# EAGLE design nanov6 (EAGLE 6.5.0)
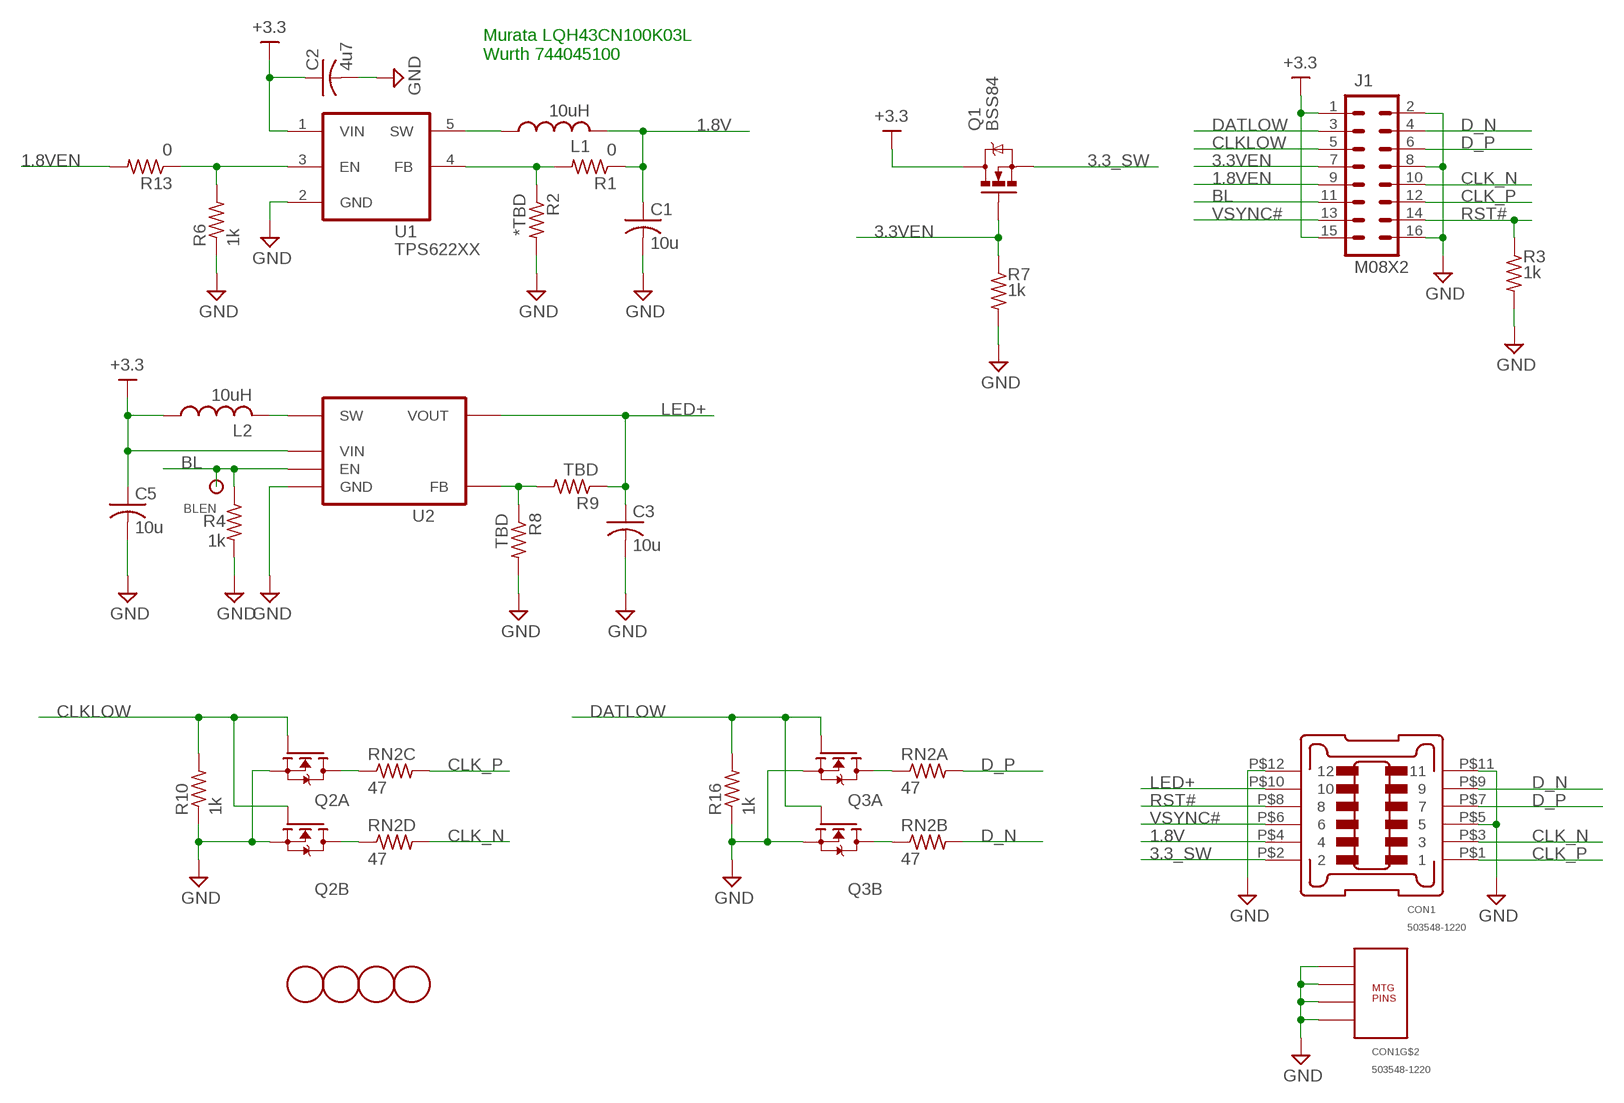
[diagram p0: schematic, sheet 1]

## Parts
BLEN  TESTPOINTKEYSTONE_5016  [5016]
C1  10u  C-USC0805  [C0805]
C2  4u7  C-USC0805  [C0805]
C3  10u  C-USC0805  [C0805]
C5  10u  C-USC0805  [C0805]
CON1  503548-1220  [503548-1220]
J1  M08X2  [2X8]
L1  10uH  L-USL1812  [L1812]
L2  10uH  L-USL1812  [L1812]
Q1  BSS84  MOSFET-NCHANNELSMD  [SOT23-3]
Q2  2N7002SC70-6  [SC70-6]
Q3  2N7002SC70-6  [SC70-6]
R1  0  R-US_R0805  [R0805]
R2  *TBD  R-US_R0805  [R0805]
R3  1k  R-US_R0805  [R0805]
R4  1k  R-US_R0805  [R0805]
R6  1k  R-US_R0805  [R0805]
R7  1k  R-US_R0805  [R0805]
R8  TBD  R-US_R0805  [R0805]
R9  TBD  R-US_R0805  [R0805]
R10  1k  R-US_R0805  [R0805]
R13  0  R-US_R0805  [R0805]
R16  1k  R-US_R0805  [R0805]
RN2  47  RES_NETWORK0805  [2008]
U1  TPS622XX  [SOT23-5]
U2  TLV61220  [SOT23-6]
U$2  MOUNTING_HOLE125  [HOLE_MTG_125]
U$3  MOUNTING_HOLE125  [HOLE_MTG_125]
U$11  MOUNTING_HOLE125  [HOLE_MTG_125]
U$15  MOUNTING_HOLE125  [HOLE_MTG_125]

## Nets
1.8V: C1.1 CON1.P$4 L1.2 R1.1
1.8VEN: J1.9 R13.2
3.3_SW: CON1.P$2 Q1.2(S)
3.3VEN: J1.7 Q1.1(G) R7.1
+3.3: C2.1 C5.1 J1.1 J1.15 L2.1 Q1.3(D) U1.1(VIN) U2.6(VIN)
BL: BLEN.P$1 J1.11 R4.1 U2.3(EN)
CLK_N [MIPI]: CON1.P$3 J1.10 RN2.5
CLK_P [MIPI]: CON1.P$1 J1.12 RN2.6
CLKLOW: J1.5 Q2.2(B:G) Q2.5(A:G) R10.2
D_N [MIPI]: CON1.P$9 J1.4 RN2.7
D_P [MIPI]: CON1.P$7 J1.6 RN2.8
DATLOW: J1.3 Q3.2(B:G) Q3.5(A:G) R16.2
GND: C1.2 C2.2 C3.2 C5.2 CON1.MTG1 CON1.MTG2 CON1.MTG3 CON1.MTG4 CON1.P$5 CON1.P$11 CON1.P$12 J1.2 J1.8 J1.16 Q2.1(B:S) Q2.4(A:S) Q3.1(B:S) Q3.4(A:S) R2.2 R3.2 R4.2 R6.1 R7.2 R8.2 R10.1 R16.1 U1.2(GND) U2.2(GND)
LED+: C3.1 CON1.P$10 R9.1 U2.5(VOUT)
N$1: R6.2 R13.1 U1.3(EN)
N$2: L1.1 U1.5(SW)
N$7: L2.2 U2.1(SW)
N$13: R8.1 R9.2 U2.4(FB)
N$16: Q2.3(A:D) RN2.3
N$17: Q2.6(B:D) RN2.4
N$18: Q3.3(A:D) RN2.1
N$19: Q3.6(B:D) RN2.2
N$23: R1.2 R2.1 U1.4(FB)
RST#: CON1.P$8 J1.14 R3.1
VSYNC#: CON1.P$6 J1.13

## Notes on the sheet
- Murata LQH43CN100K03L
  Wurth 744045100

## Library data of the parts
BLEN = ak-misc:TESTPOINT: Various test points
C1-C3 C5 = rcl:C-US: CAPACITOR, American symbol
CON1 = ak-misc:503548-1220
J1 = SparkFun:M08X2
L1 L2 = rcl:L-US: INDUCTOR, American symbol
Q1 = SparkFun:MOSFET-NCHANNEL
Q2 Q3 = ak-misc:2N7002
R1-R4 R6-R10 R13 R16 = rcl:R-US_: RESISTOR, American symbol
RN2 = ak-misc:RES_NETWORK
U1 = ak-misc:TPS622XX
U2 = ak-misc:TLV61220
U$2 U$3 U$11 U$15 = ak-misc:MOUNTING_HOLE

## Net classes
1 MIPI: width 0.3 mm, drill 0.3 mm, clearance 0.15 mm

## Board
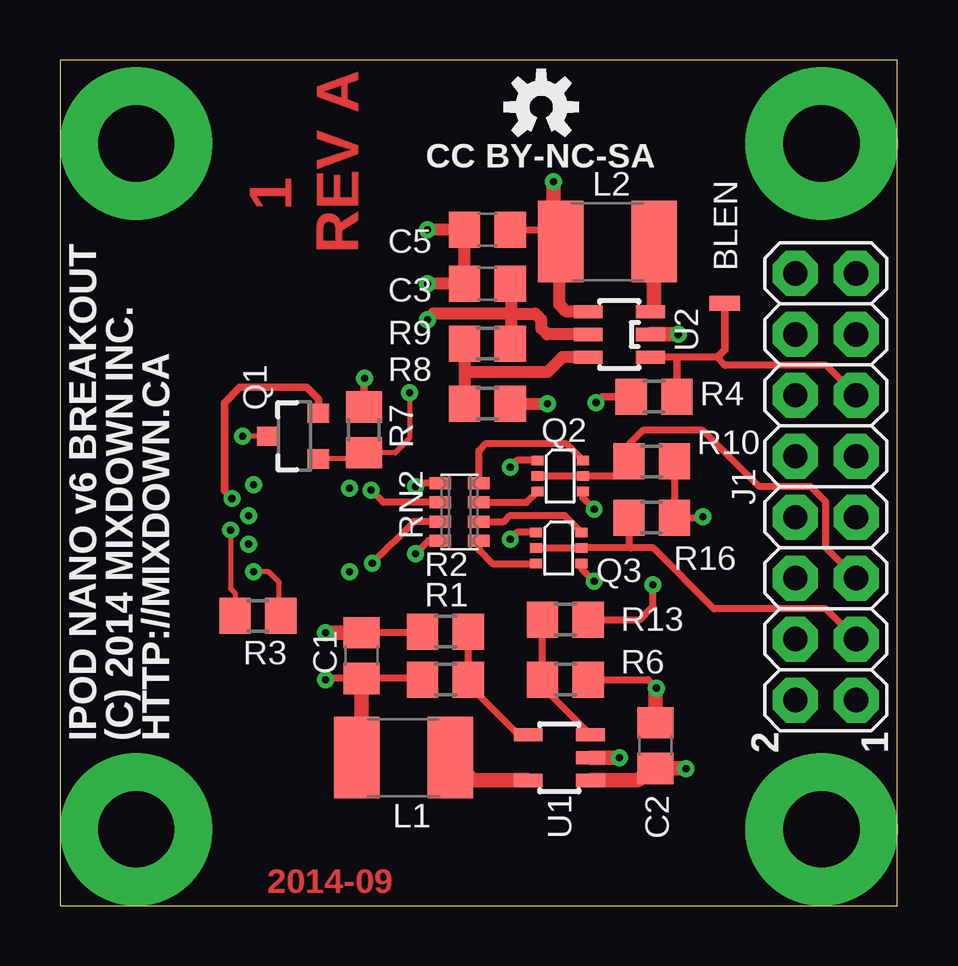
[diagram p1: board, top side]
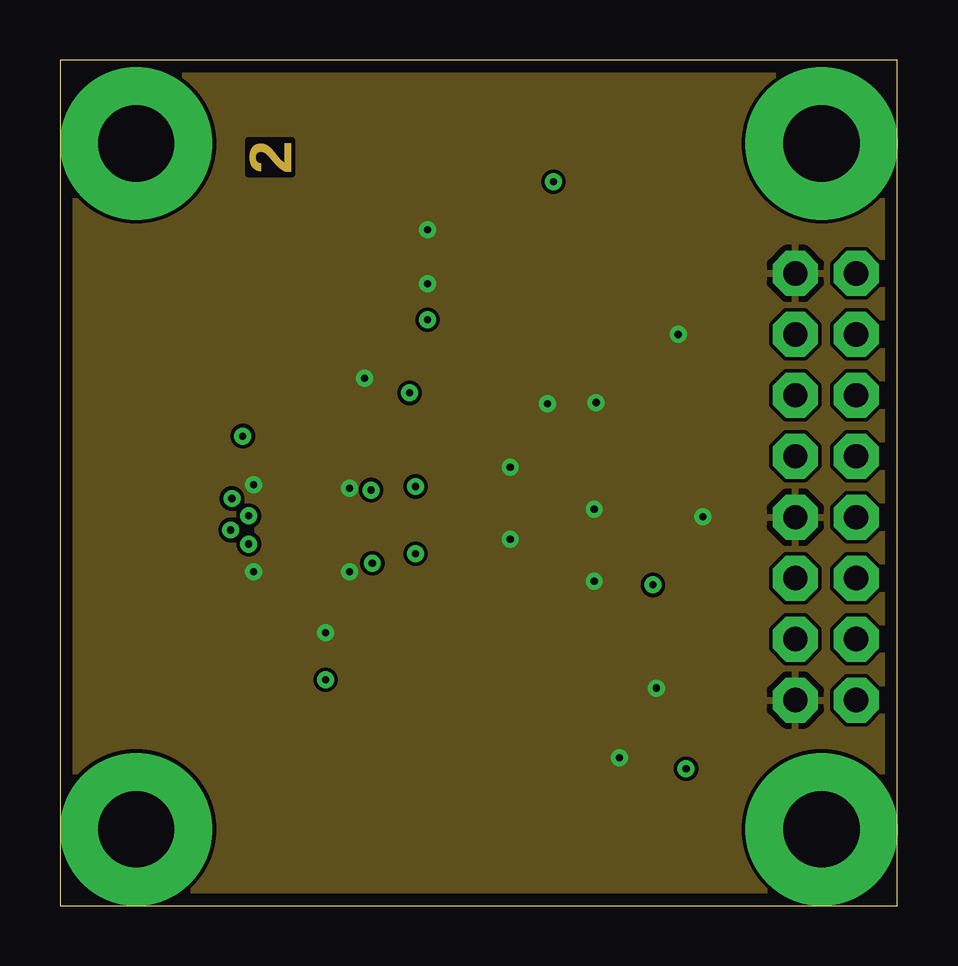
[diagram p2: board, inner layer Route2]
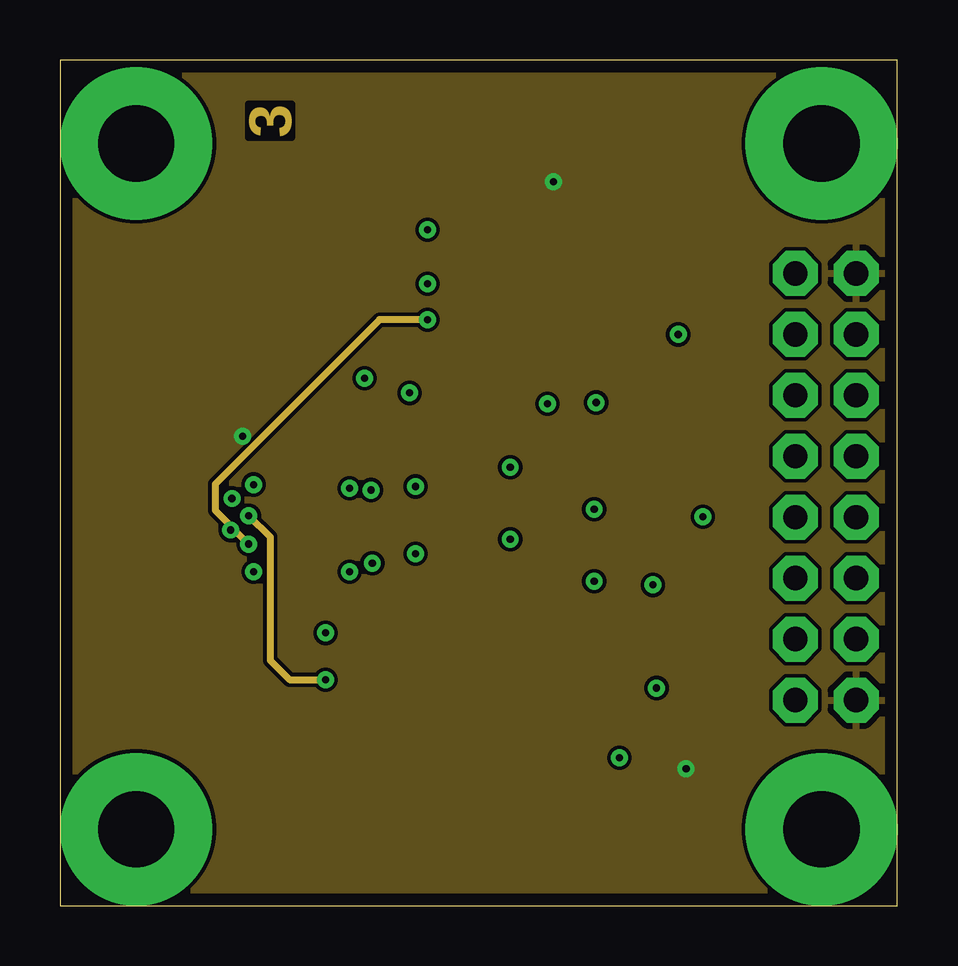
[diagram p3: board, inner layer Route15]
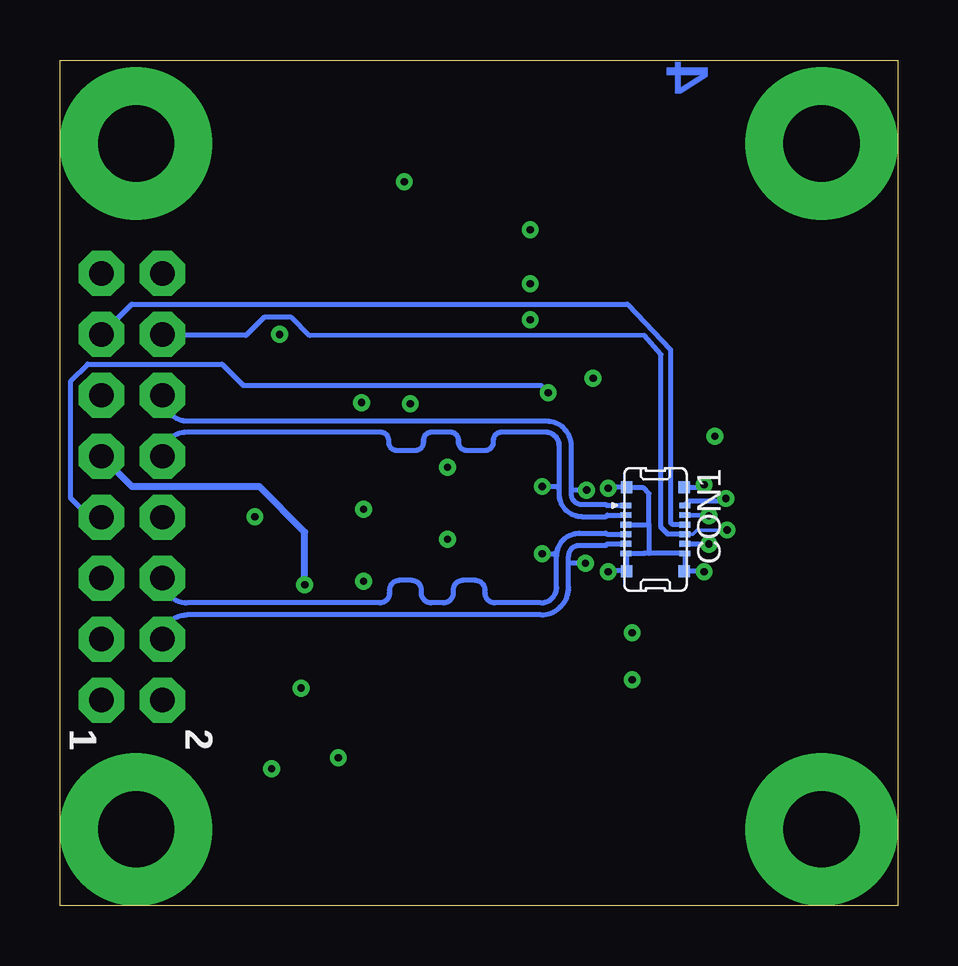
[diagram p4: board, bottom side, seen from below]

Size 34.91 x 35.23 mm. Coordinates in mm from the lower left corner, seen from the top.
Outline: 0,0 34.91,0 34.91,35.23 0,35.23 0,0
Copper layers (1+2*15+16): Top 0.0178mm / dielectric 12mil / Route2 0.0356mm / dielectric 28mil / Route15 0.0356mm / dielectric 12mil / Bottom 0.0178mm
Design rules "ssc-4l-thermals-stopmask-via": minimum track width 6mil, minimum drill 8mil, track to track 6mil, track to pad 6mil, pad to pad 6mil, via to via 6mil, smd to smd 6mil, copper to edge 20mil, drill to drill 16mil, minimum pad ring 8mil, minimum via ring 8mil, stop-mask expansion 3mil, vias tented up to drill 12mil, thermal gap 10mil

### Footprints (pad centres in the part's own frame; a part is rotated, then mirrored left to right if it is on the bottom)
5016 = smd 1.27 x 0.635: P$1 0,0
C0805 = smd 1.3 x 1.5: 1 -0.95,0; 2 0.95,0
503548-1220 = smd 0.5 x 0.47: MTG1 1.75,1.195; MTG2 1.75,-1.195; MTG3 -1.75,-1.195; MTG4 -1.75,1.195 | smd 0.24 x 0.45: P$1 1,1.225; P$2 1,-1.225; P$3 0.6,1.225; P$4 0.6,-1.225; P$5 0.2,1.225; P$6 0.2,-1.225; P$7 -0.2,1.225; P$8 -0.2,-1.225; P$9 -0.6,1.225; P$10 -0.6,-1.225; P$11 -1,1.225; P$12 -1,-1.225
2X8 = drill 1.016 pad 1.88 octagon: 1 0,0; 2 0,2.54; 3 2.54,0; 4 2.54,2.54; 5 5.08,0; 6 5.08,2.54; 7 7.62,0; 8 7.62,2.54; 9 10.16,0; 10 10.16,2.54; 11 12.7,0; 12 12.7,2.54; 13 15.24,0; 14 15.24,2.54; 15 17.78,0; 16 17.78,2.54
L1812 = smd 1.9 x 3.4: 1 -1.95,0; 2 1.95,0
SOT23-3 = smd 0.8 x 0.9: 1 -0.95,-1; 2 0.95,-1; 3 0,1.1
SC70-6 = smd 0.5 x 0.4: 1 -0.95,0.65; 2 -0.95,0; 3 -0.95,-0.65; 4 0.95,-0.65; 5 0.95,0; 6 0.95,0.65
R0805 = smd 1.3 x 1.5: 1 -0.95,0; 2 0.95,0
2008 = smd 0.5 x 0.9: 1 -1.2,-0.8; 2 -0.4,-0.8; 3 0.4,-0.8; 4 1.2,-0.8; 5 1.2,0.8; 6 0.4,0.8; 7 -0.4,0.8; 8 -1.2,0.8
SOT23-5 = smd 0.55 x 1.2: 1 -0.95,-1.3; 2 0,-1.3; 3 0.95,-1.3; 4 0.95,1.3; 5 -0.95,1.3
SOT23-6 = smd 0.55 x 1.2: 1 0.95,-1.3; 2 0,-1.3; 3 -0.95,-1.3; 4 -0.95,1.3; 5 0,1.3; 6 0.95,1.3
HOLE_MTG_125 = drill 3.175 pad 6.35: P$1 0,0

### Placement (x,y rotation side)
BLEN  27.71,25.09 0 top
C1  12.57,10.41 90 top
C2  24.82,6.66 90 top
C3  17.82,25.91 180 top
C5  17.82,28.16 180 top
CON1  10.1,15.67 90 bottom
J1  33.2,8.56 90 top
L1  14.32,6.16 180 top
L2  22.82,27.66 0 top
Q1  9.78,19.56 90 top
Q2  20.85,17.9 0 top
Q3  20.79,14.9 0 top
R1  16.07,9.41 0 top
R2  16.07,11.41 180 top
R3  8.26,12.06 0 top
R4  24.77,21.21 180 top
R6  21.07,9.41 180 top
R7  12.67,19.82 90 top
R8  17.82,20.91 0 top
R9  17.82,23.41 180 top
R10  24.67,18.51 180 top
R13  21.07,11.91 0 top
R16  24.67,16.16 180 top
RN2  16.66,16.4 90 top
U1  20.82,6.16 90 top
U2  23.32,23.8 90 top
U$2  3.17,3.17 0 top
U$3  31.75,3.17 0 top
U$11  31.75,31.75 0 top
U$15  3.17,31.75 0 top

### Tracks (layer width: path | path; a pad name or v marks a point on that pad's centre or on a via)
1.8V  (via drill 0.3 pad 0.3)
  Top 0.3: R1.1 15.07,9.46 C1.1 11.12,9.46 v11.07,9.41 | L1.2 12.57,6.36
  Top 0.6: 12.57,6.36 C1.1
  Route15 0.3: v11.07,9.41 9.57,9.41 8.77,10.21 8.77,15.36 v7.87,16.23
  Bottom 0.2: v7.87,16.23 8.87,16.26 CON1.P$4
1.8VEN  (via drill 0.3 pad 0.3)
  Top 0.3: R13.2 24.17,11.91 24.72,12.46 v24.72,13.36
  Bottom 0.3: v24.72,13.36 24.72,15.56 26.62,17.46 31.93,17.46 J1.9
3.3_SW  (via drill 0.3 pad 0.3)
  Top 0.305: Q1.2 10.78,21.1 10.29,21.59 7.49,21.59 6.86,20.95 6.86,17.27 v7.17,16.96
  Bottom 0.2: CON1.P$2 8.69,16.86 7.27,16.86 v7.17,16.96
3.3VEN  (via drill 0.3 pad 0.3)
  Top 0.2: v14.57,21.36 14.57,19.46 13.97,18.86 R7.1
  Top 0.203: R7.1 12.43,18.61 Q1.1
  Bottom 0.2: J1.7 33.7,16.18 34.48,16.96 34.48,21.86 33.77,22.56 28.17,22.56 27.27,21.66 14.87,21.66 v14.57,21.36
+3.3  (via drill 0.3, 0.3 pad 0.3)
  Top 0.203: Q1.3 v7.62,19.56
  Top 0.3: 20.82,27.11 L2.1 | C5.1 20.32,28.16 21.07,27.41
  Top 0.5: U2.6 21.12,24.75 20.82,25.05 20.82,27.11 | 20.57,28.16 21.07,27.66 21.07,27.41 21.07,27.11 L2.1
  Top 0.6: U1.1 24.07,5.21 C2.1 v26.09,5.71 v26.1,5.7 | 20.57,28.16 v20.57,30.16
  pour Route15: 35.32,0.64 35.32,34.73 0.42,34.73 0.42,0.64
BL
  Top 0.3: J1.11 31.95,22.51 27.72,22.51 27.71,22.52 27.4,22.84 25.78,22.84 U2.3
  Top 0.305: BLEN.P$1 27.71,23.16 27.4,22.84 | R4.1 25.71,22.78 25.78,22.84
CLK_N  (via drill 0.3 pad 0.3)
  Top 0.3: 14.86,17.5 v14.82,17.46 14.96,17.6 RN2.5
  Bottom 0.2: 12.17,16.21 12.11,16.27
  Bottom 0.203: J1.10 arc90 29.64,19.73 21.57,19.73 arc90 21.23,19.39 21.23,19.31 arc-90 20.88,18.97 20.11,18.97 arc-90 19.77,19.31 19.77,19.39 arc90 19.42,19.73 18.66,19.73 arc90 18.31,19.39 18.31,19.31 arc-90 17.97,18.97 17.2,18.97 arc-90 16.86,19.31 16.86,19.39 arc90 16.51,19.73 14.69,19.73 arc90 14.12,19.16 14.12,17.36 | 14.12,17.36 14.12,17.16 arc-90 13.17,16.21 | 13.17,16.21 12.17,16.21 | 12.11,16.27 CON1.P$3 | 13.17,16.21 | v14.82,17.46 14.22,17.46 14.12,17.36
CLK_P  (via drill 0.3 pad 0.3)
  Top 0.3: RN2.6 13.48,16.8 v12.97,17.31
  Bottom 0.203: J1.12 arc-90 29.58,20.19 14.65,20.19 arc90 13.62,19.16 13.62,17.36 | 13.62,17.36 13.62,17.16 arc-90 13.17,16.71 12.17,16.71 12.13,16.67 CON1.P$1 | v12.97,17.31 13.57,17.31 13.62,17.36
CLKLOW
  Top 0.3: Q2.2 Q2.5 23.11,17.9 R10.2 23.72,19.22 24.3,19.8 26.8,19.8 29.15,17.45 31.3,17.45 31.93,16.82 31.93,14.91 J1.5
D_N  (via drill 0.3 pad 0.3)
  Top 0.3: v13.02,14.26 14.76,16 RN2.7
  Bottom 0.2: 12.17,15.01 arc90 12.16,15.02 12.11,15.07 CON1.P$9
  Bottom 0.203: J1.4 arc90 29.65,12.11 14.87,12.11 arc-90 13.72,13.26 13.72,14.26 | 13.72,14.26 13.72,14.56 arc90 13.27,15.01 12.17,15.01 | v13.02,14.26 13.72,14.26
D_P  (via drill 0.3 pad 0.3)
  Top 0.3: RN2.8 15.36,15.2 v14.82,14.66
  Bottom 0.2: 12.17,15.51 12.13,15.47 CON1.P$7
  Bottom 0.203: J1.6 arc-90 29.63,12.61 21.59,12.61 arc-90 21.19,13.02 21.19,13.14 arc90 20.78,13.55 20.26,13.55 arc90 19.86,13.14 19.86,13.02 arc-90 19.45,12.61 18.94,12.61 arc-90 18.53,13.02 18.53,13.14 arc90 18.13,13.55 17.61,13.55 arc90 17.21,13.14 17.21,13.02 arc-90 16.8,12.61 14.87,12.61 arc-90 14.22,13.26 14.22,14.56 | 14.22,14.56 arc90 13.27,15.51 12.17,15.51 | v14.82,14.66 14.32,14.66 14.22,14.56
DATLOW
  Top 0.3: Q3.2 Q3.5 | Q3.5 | J1.3 31.93,12.36 27.27,12.36 24.73,14.9 23.8,14.9 | 23.8,14.9 Q3.5 | 23.67,16.41 R16.2 23.72,14.98 23.8,14.9
GND  (via drill 0.3, 0.3 pad 0.3)
  Top 0.152: R3.2 9.14,12.13
  Top 0.203: 9.14,12.13 9.14,13.46 8.7,13.91 v8.07,13.91
  Top 0.3: Q2.1 19.06,18.55 v18.77,18.26 | Q2.4 21.8,16.98 v22.27,16.51 | Q3.1 19.06,15.55 v18.77,15.26 | Q3.4 21.74,14.04 v22.27,13.51 | R2.2 14.57,11.36 C1.2 | R6.1 24.52,9.41 v24.87,9.06 | R10.1 R16.1 26.76,16.16 v26.8,16.2
  Top 0.305: R7.2 12.67,21.81 v12.7,21.97 | R4.2 22.61,21.21 v22.35,20.95
  Top 0.5: v15.32,28.16 C5.2 C3.2 v15.32,25.91 | R8.2 v20.32,20.91
  Top 0.6: C1.2 v11.07,11.36 | U1.2 v23.32,6.16 | U2.2 v25.77,23.8 | C2.2 24.82,8.81 v24.87,9.06
  Bottom 0.2: CON1.P$11 10.57,14.66 10.56,14.67 | CON1.P$11 | 10.37,14.67 CON1.P$12 8.88,13.95 | 10.37,14.67 10.56,14.67 | 10.57,14.68 10.56,14.67 | CON1.P$11 11.31,13.94 | 11.31,13.94 CON1.MTG4 | 8.88,13.95 CON1.MTG3 | CON1.MTG2 8.08,17.42 v8.07,17.54 | CON1.P$5 10.37,15.87 | v12.07,17.39 12.06,17.42 CON1.MTG1 10.63,17.42 10.37,17.16 10.37,15.87 | 11.31,13.94 12.04,13.94 v12.07,13.91 | 8.88,13.95 8.11,13.95 v8.07,13.91 | 10.37,15.87 10.37,14.67
  pour Route2: 34.69,0.64 34.69,34.73 0.42,34.73 0.42,0.64
LED+  (via drill 0.3 pad 0.3)
  Top 0.5: U2.5 20.32,23.8 20.07,24.05 20.07,24.41 19.82,24.66 18.82,24.66 | R9.1 18.82,23.46 18.82,24.66 | 18.82,24.66 18.82,25.86 C3.1 | 18.82,24.66 15.57,24.66 v15.32,24.41
  Route15 0.3: v15.32,24.41 13.32,24.41 6.47,17.56 6.47,16.46 v7.87,15.06
  Bottom 0.2: v7.87,15.06 8.87,15.06 CON1.P$10
N$1
  Top 0.3: U1.3 20.12,9.11 R6.2 R13.1
N$2
  Top 0.6: U1.5 17.22,5.21 L1.1
N$7
  Top 0.203: U2.1 24.77,24.89
  Top 0.6: 24.77,24.89 L2.2
N$13
  Top 0.5: 20.32,22.23 16.87,22.21 | 16.87,22.21 R8.1 | R9.2 16.87,22.21
  Top 0.508: U2.4 20.94,22.84 20.32,22.23
N$16
  Top 0.3: RN2.3 19.45,16.8 Q2.3
N$17
  Top 0.3: RN2.4 17.46,18.95 17.77,19.26 21.09,19.26 Q2.6
N$18
  Top 0.3: RN2.1 17.46,14.82 18.03,14.25 Q3.3
N$19
  Top 0.3: RN2.2 18.51,16 18.77,16.26 21.03,16.26 Q3.6
N$23
  Top 0.3: U1.4 19.12,7.11 17.02,9.21 R1.2 R2.1
RST#  (via drill 0.3)
  Top 0.203: v7.11,15.65 7.11,13.21 7.3,13.02 R3.1
  Bottom 0.152: CON1.P$8 8.53,15.47 8.38,15.65 v7.11,15.65
  Bottom 0.2: CON1.P$8 9.58,15.47 9.87,15.76 9.87,22.96 10.57,23.76 24.51,23.75 25.27,24.51 26.42,24.51 27.17,23.76 30.61,23.76 J1.14
VSYNC#
  Bottom 0.2: CON1.P$6 9.38,15.87 9.47,15.96 9.47,23.16 11.27,25.06 31.93,25.06 J1.13

### Text on the board
Top: 1 | REV A | 2014-09
Route2: 2
Route15: 3
Bottom: 4
tPlace: CC BY-NC-SA | IPOD NANO v6 BREAKOUT | (C) 2014 MIXDOWN INC. | HTTP://MIXDOWN.CA | 2 | 1
bPlace: 2 | 1